# EAGLE design Wizard (EAGLE 9.4.0)
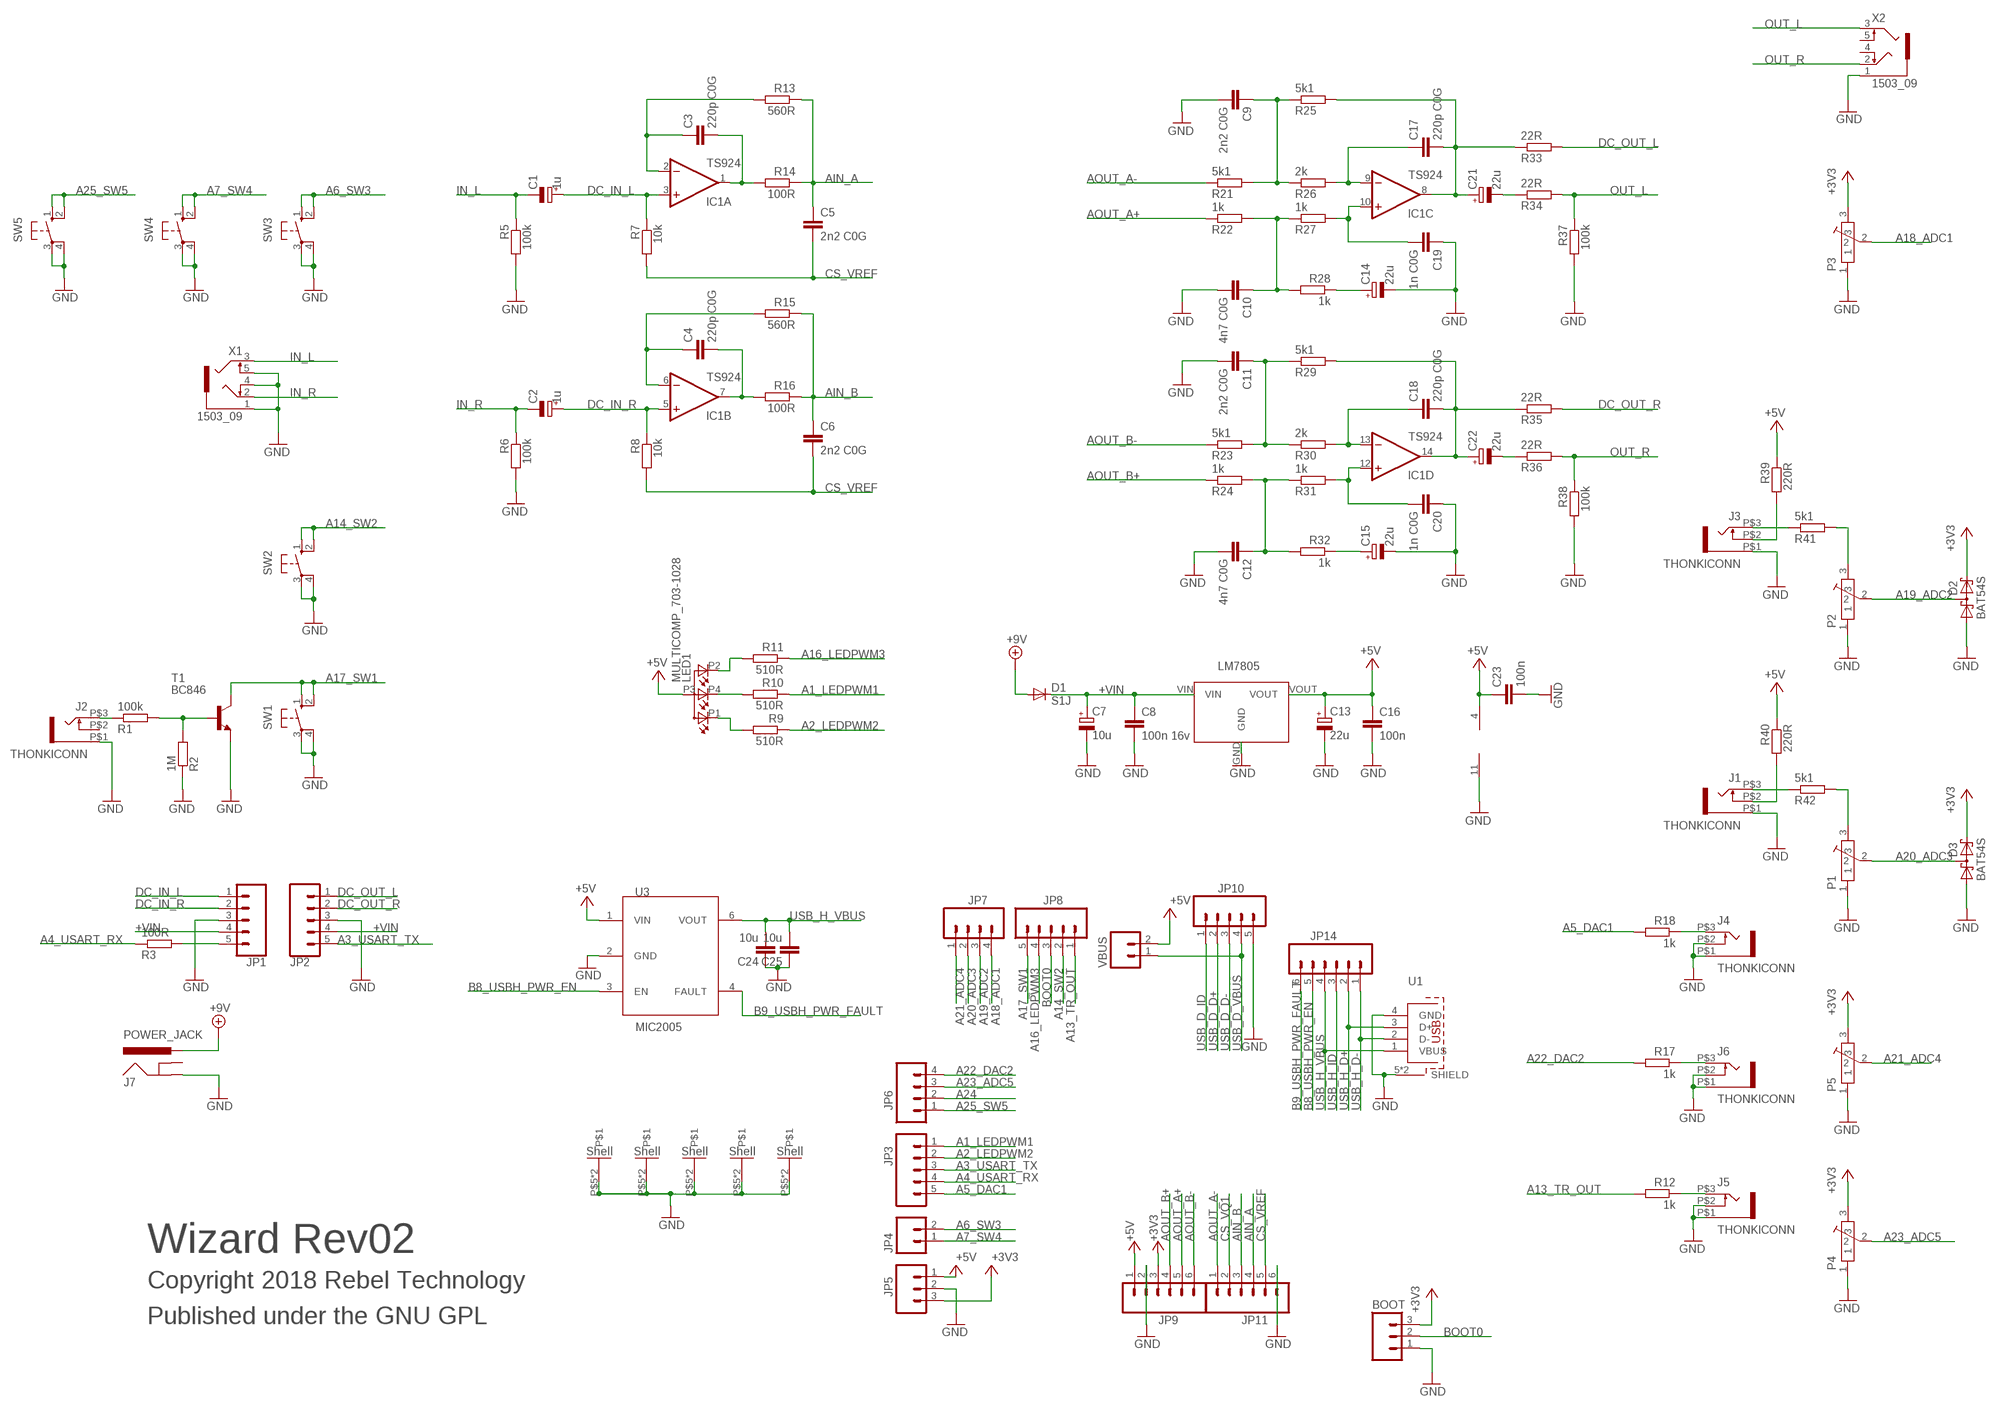
[diagram p0: schematic, sheet 1]

## Parts
BOOT  M03PTH  [1X03]
C1  1u  CPOL-EU153CLV-0405  [153CLV-0405]
C2  1u  CPOL-EU153CLV-0405  [153CLV-0405]
C3  220p C0G  C-EUC0603  [C0603]
C4  220p C0G  C-EUC0603  [C0603]
C5  2n2 C0G  C-EUC0603  [C0603]
C6  2n2 C0G  C-EUC0603  [C0603]
C7  10u  CPOL-EU153CLV-0405  [153CLV-0405]
C8  100n 16v  C-EUC0603  [C0603]
C9  2n2 C0G  C-EUC0603  [C0603]
C10  4n7 C0G  C-EUC0603  [C0603]
C11  2n2 C0G  C-EUC0603  [C0603]
C12  4n7 C0G  C-EUC0603  [C0603]
C13  22u  CPOL-EU153CLV-0505  [CPOL-5]
C14  22u  CPOL-EU153CLV-0505  [CPOL-5]
C15  22u  CPOL-EU153CLV-0505  [CPOL-5]
C16  100n  C-EUC0603  [C0603]
C17  220p C0G  C-EUC0603  [C0603]
C18  220p C0G  C-EUC0603  [C0603]
C19  1n C0G  C-EUC0603  [C0603]
C20  1n C0G  C-EUC0603  [C0603]
C21  22u  CPOL-EU153CLV-0505  [CPOL-5]
C22  22u  CPOL-EU153CLV-0505  [CPOL-5]
C23  100n  C-EUC0603  [C0603]
C24  10u  C-EUC0603  [C0603]
C25  10u  C-EUC0603  [C0603]
D1  S1J  DIODESMA  [SMA-DIODE]
D2  BAT54S  [SOT23]
D3  BAT54S  [SOT23]
IC1  TS924  LM324D  [SO14]
J1  THONKICONN  [THONKICONN]
J2  THONKICONN  [THONKICONN]
J3  THONKICONN  [THONKICONN]
J4  THONKICONN  [THONKICONN]
J5  THONKICONN  [THONKICONN]
J6  THONKICONN  [THONKICONN]
J7  POWER_JACK  [DC_JACK_SLOT]
JP1  CONN_05JST-VERT  [JST-5-PTH-VERT]
JP2  CONN_05JST-VERT  [JST-5-PTH-VERT]
JP3  M05PTH  [1X05]
JP4  M02PTH  [1X02]
JP5  M03PTH  [1X03]
JP6  M04PTH  [1X04]
JP7  M04PTH  [1X04]
JP8  M05PTH  [1X05]
JP9  M06SIP  [1X06]
JP10  M05PTH  [1X05]
JP11  M06SIP  [1X06]
JP14  M06SIP  [1X06]
LED1  MULTICOMP_703-1028  [RGB-LED-703-1028]
P1  POT-ALPS-RK09L1140  [POT-ALPS-RK09L1140]
P2  POT-ALPS-RK09L1140  [POT-ALPS-RK09L1140]
P3  POT-ALPS-RK09L1140  [POT-ALPS-RK09L1140]
P4  POT-ALPS-RK09L1140  [POT-ALPS-RK09L1140]
P5  POT-ALPS-RK09L1140  [POT-ALPS-RK09L1140]
R1  100k  R-EU_0603  [0603]
R2  1M  R-EU_0603  [0603]
R3  100R  R-EU_0603  [0603]
R5  100k  R-EU_0603  [0603]
R6  100k  R-EU_0603  [0603]
R7  10k  R-EU_0603  [0603]
R8  10k  R-EU_0603  [0603]
R9  510R  R-EU_0603  [0603]
R10  510R  R-EU_0603  [0603]
R11  510R  R-EU_0603  [0603]
R12  1k  R-EU_0603  [0603]
R13  560R  R-EU_0603  [0603]
R14  100R  R-EU_0603  [0603]
R15  560R  R-EU_0603  [0603]
R16  100R  R-EU_0603  [0603]
R17  1k  R-EU_0603  [0603]
R18  1k  R-EU_0603  [0603]
R21  5k1  R-EU_0603  [0603]
R22  1k  R-EU_0603  [0603]
R23  5k1  R-EU_0603  [0603]
R24  1k  R-EU_0603  [0603]
R25  5k1  R-EU_0603  [0603]
R26  2k  R-EU_0603  [0603]
R27  1k  R-EU_0603  [0603]
R28  1k  R-EU_0603  [0603]
R29  5k1  R-EU_0603  [0603]
R30  2k  R-EU_0603  [0603]
R31  1k  R-EU_0603  [0603]
R32  1k  R-EU_0603  [0603]
R33  22R  R-EU_0603  [0603]
R34  22R  R-EU_0603  [0603]
R35  22R  R-EU_0603  [0603]
R36  22R  R-EU_0603  [0603]
R37  100k  R-EU_0603  [0603]
R38  100k  R-EU_0603  [0603]
R39  220R  R-EU_0603  [0603]
R40  220R  R-EU_0603  [0603]
R41  5k1  R-EU_0603  [0603]
R42  5k1  R-EU_0603  [0603]
SW1  10-XX  [B3F-10XX]
SW2  10-XX  [B3F-10XX]
SW3  10-XX  [B3F-10XX]
SW4  10-XX  [B3F-10XX]
SW5  10-XX  [B3F-10XX]
T1  BC846  [SOT23]
U1  614104190121  [614104190121]
U2  LM7805  REG_S9V11F5  [REG_S9V11F5]
U3  MIC2005  [SOT23-6]
VBUS  M02PTH  [1X02]
X1  1503_09  [1503_09]
X2  1503_09  [1503_09]

## Nets
+3V3: BOOT.3 D2.2(C2) D3.2(C2) JP5.3 JP9.3 P3.3 P4.3 P5.3
+5V: C13.+ C16.1 C23.1 IC1.4(P:V+) JP5.1 JP9.1 LED1.P3(A) R39.1 R40.1 U2.VOUT U3.1(VIN) VBUS.2
+9V: D1.A J7.PWR
+VIN: C7.+ C8.1 D1.C JP1.4 JP2.4 U2.VIN
A1_LEDPWM1: JP3.1 R10.1
A2_LEDPWM2: JP3.2 R9.1
A3_USART_TX: JP2.5 JP3.3
A4_USART_RX: JP3.4 R3.1
A5_DAC1: JP3.5 R18.2
A6_SW3: JP4.2 SW3.1(S) SW3.2(S1)
A7_SW4: JP4.1 SW4.1(S) SW4.2(S1)
A13_TR_OUT: JP8.1 R12.2
A14_SW2: JP8.2 SW2.1(S) SW2.2(S1)
A16_LEDPWM3: JP8.4 R11.1
A17_SW1: JP8.5 SW1.1(S) SW1.2(S1) T1.3(C)
A18_ADC1: JP7.4 P3.2
A19_ADC2: D2.3(C1A2) JP7.3 P2.2
A20_ADC3: D3.3(C1A2) JP7.2 P1.2
A21_ADC4: JP7.1 P5.2
A22_DAC2: JP6.4 R17.2
A23_ADC5: JP6.3 P4.2
A24: JP6.2
A25_SW5: JP6.1 SW5.1(S) SW5.2(S1)
AIN_A: C5.1 JP11.4 R13.1 R14.1
AIN_B: C6.1 JP11.3 R15.1 R16.1
AOUT_A+: JP9.5 R22.1
AOUT_A-: JP11.1 R21.1
AOUT_B+: JP9.4 R24.1
AOUT_B-: JP9.6 R23.1
B8_USBH_PWR_EN: JP14.5 U3.3(EN)
B9_USBH_PWR_FAULT: JP14.6 U3.4(FAULT)
BOOT0: BOOT.2 JP8.3
CS_VQ1: JP11.2
CS_VREF: C5.2 C6.2 JP11.5 R7.2 R8.2
DC_IN_L: C1.+ IC1.3(A:+IN) JP1.1 R7.1
DC_IN_R: C2.+ IC1.5(B:+IN) JP1.2 R8.1
DC_OUT_L: JP2.1 R33.2
DC_OUT_R: JP2.2 R35.2
GND: BOOT.1 C7.- C8.2 C9.2 C10.2 C11.2 C12.2 C13.- C14.- C15.- C16.2 C19.1 C20.1 C23.2 C24.1 C25.1 D2.1(A1) D3.1(A1) IC1.11(P:V-) J1.P$1 J2.P$1 J3.P$1 J4.P$1 J4.P$2 J5.P$1 J5.P$2 J6.P$1 J6.P$2 J7.GND JP1.3 JP2.3 JP5.2 JP9.2 JP10.5 JP11.6 P1.1 P1.P$5 P1.P$6 P2.1 P2.P$5 P2.P$6 P3.1 P3.P$5 P3.P$6 P4.1 P4.P$5 P4.P$6 P5.1 P5.P$5 P5.P$6 R2.1 R5.2 R6.2 R37.2 R38.2 SW1.3(P) SW1.4(P1) SW2.3(P) SW2.4(P1) SW3.3(P) SW3.4(P1) SW4.3(P) SW4.4(P1) SW5.3(P) SW5.4(P1) T1.2(E) U1.4(GND) U1.5(SHIELD) U1.6(SHIELD) U2.GND U3.2(GND) X1.1 X1.4 X1.5 X2.1
IN_L: C1.- R5.1 X1.3
IN_R: C2.- R6.1 X1.2
N$1: JP1.5 R3.2
N$2: J1.P$2 R40.2
N$3: C3.1 IC1.2(A:-IN) R13.2
N$4: C4.2 IC1.7(B:OUT) R16.2
N$5: C4.1 IC1.6(B:-IN) R15.2
N$6: C3.2 IC1.1(A:OUT) R14.2
N$7: C17.1 IC1.9(C:-IN) R26.2
N$8: C15.+ R32.1
N$9: C21.- R34.1
N$10: C14.+ R28.1
N$11: C19.2 IC1.10(C:+IN) R27.2
N$12: C18.2 C22.+ IC1.14(D:OUT) R29.2 R35.1
N$13: C22.- R36.1
N$14: LED1.P2(CGREEN) R11.2
N$15: C10.1 R22.2 R27.1 R28.2
N$16: LED1.P1(CRED) R9.2
N$17: LED1.P4(CBLUE) R10.2
N$19: J5.P$3 R12.1
N$20: J6.P$3 R17.1
N$21: J4.P$3 R18.1
N$22: J2.P$3 R1.1
N$23: J3.P$2 R39.2
N$24: C11.1 R23.2 R29.1 R30.1
N$25: P2.3 R41.2
N$26: C18.1 IC1.13(D:-IN) R30.2
N$27: J3.P$3 R41.1
N$30: C20.2 IC1.12(D:+IN) R31.2
N$31: P1.3 R42.2
N$32: C12.1 R24.2 R31.1 R32.2
N$33: J1.P$3 R42.1
N$37: R1.2 R2.2 T1.1(B)
N$39: C17.2 C21.+ IC1.8(C:OUT) R25.2 R33.1
N$41: C9.1 R21.2 R25.1 R26.1
OUT_L: R34.2 R37.1 X2.3
OUT_R: R36.2 R38.1 X2.2
USB_D_D+: JP10.2
USB_D_D-: JP10.3
USB_D_ID: JP10.1
USB_D_VBUS: JP10.4 VBUS.1
USB_H_D+: JP14.2 U1.3(D+)
USB_H_D-: JP14.1 U1.2(D-)
USB_H_ID: JP14.3
USB_H_VBUS: C24.2 C25.2 JP14.4 U1.1(VBUS) U3.6(VOUT)
Unconnected: J2.P$2 J7.GNDBREAK X2.4 X2.5

## Notes on the sheet
- Wizard Rev02
- Copyright 2018 Rebel Technology
- Published under the GNU GPL

## Library data of the parts
BOOT JP5 = SparkFun:M03: Header 3 Standard 3-pin 0.1" header. Use with straight break away headers (SKU : PRT-00116), right angle break away headers (PRT-00553), swiss pins (PRT-00743), machine pins (PRT-00117), and female headers (PRT-00115). Molex polarized connector foot print use with SKU : PRT-08232 with associated crimp pins and housings.
C1 C2 C7 C13-C15 C21 C22 = Rebel:CPOL-EU: POLARIZED CAPACITOR, European symbol
C3-C6 C9-C12 C17-C20 C23-C25 = resistor:C-EU: CAPACITOR, European symbol
C8 C16 = Rebel:C-EU: CAPACITOR, European symbol
D1 = SparkFun:DIODE: Diode These are standard reverse protection diodes and small signal diodes. SMA package can handle up to about 1A. SOD-323 can handle about 200mA. What the SOD-323 package when ordering, there are some mfgs out there that are 5-pin packages.
D2 D3 = diode:BAT54S: Schottky Diodes Pin connection corrected 2011-05-04 Source: Fairchild .. BAT54.pdf
IC1 = linear:LM324: OP AMP
J1-J6 = Rebel:THONKICONN
J7 = Rebel:POWER_JACK: Power Jack This is the standard 5.5mm barrel jack for power. The PTH is the most common, proven, reliable, footprint. All others are experimental. The Slot footprint only works if the mill layer is transmitted to the PCB fab house so be warned. Spark Fun Electronics SKU : PRT-00119. Mating wall wart : TOL-00298 (and others)
JP1 JP2 = SparkFun-Connectors:CONN_05: Multi connection point. Often used as Generic Header-pin footprint for 0.1 inch spaced/style header connections On any of the 0.1 inch spaced packages, you can populate with these: Break Away Headers - Straight <https://www.sparkfun.com/products/116> (PRT-00116) Break Away Male Headers - Right Angle <https://www.sparkfun.com/products/553> (PRT-00553) Female Headers <https://www.sparkfun.com/products/115> (PRT-00115) Break Away Headers - Machine Pin <https://www.sparkfun.com/products/117> (PRT-00117) Break Away Female Headers - Swiss Machine Pin <https://www.sparkfun.com/products/743> (PRT-00743) For SCREWTERMINALS and SPRING TERMINALS visit here: Screw Terimnals on SparkFun.com <https://www.sparkfun.com/search/results?term=Screw+Terminals> (5mm/3.5mm/2.54mm spacing) This device is also useful as a general connection point to wire up your design to another part of your project. Our various solder wires solder well into these plated through hole pads. Hook-Up Wire - Assortment (Stranded, 22 AWG) <https://www.sparkfun.com/products/11375> (PRT-11375) Hook-Up Wire - Assortment (Solid Core, 22 AWG) <https://www.sparkfun.com/products/11367> (PRT-11367) View the entire wire category on our website here <https://www.sparkfun.com/categories/141> Special notes: Molex polarized connector foot print use with SKU : PRT-08231 with associated crimp pins and housings. 1MM SMD Version SKU: PRT-10208
JP3 JP8 JP10 = SparkFun:M05: Header 5 Standard 5-pin 0.1" header. Use with straight break away headers (SKU : PRT-00116), right angle break away headers (PRT-00553), swiss pins (PRT-00743), machine pins (PRT-00117), and female headers (PRT-00115). Molex polarized connector foot print use with SKU : PRT-08230 with associated crimp pins and housings.
JP4 VBUS = SparkFun:M02: Header 2 Standard 2-pin 0.1" header. Use with straight break away headers (SKU : PRT-00116), right angle break away headers (PRT-00553), swiss pins (PRT-00743), machine pins (PRT-00117), and female headers (PRT-00115). Molex polarized connector foot print use with SKU : PRT-08233 with associated crimp pins and housings.
JP6 JP7 = SparkFun:M04: Header 4 Standard 4-pin 0.1" header. Use with straight break away headers (SKU : PRT-00116), right angle break away headers (PRT-00553), swiss pins (PRT-00743), machine pins (PRT-00117), and female headers (PRT-00115). Molex polarized connector foot print use with SKU : PRT-08231 with associated crimp pins and housings. 1MM SMD Version SKU: PRT-10208
JP9 JP11 JP14 = SparkFun:M06: Header 6 Standard 6-pin 0.1" header. Use with straight break away headers (SKU : PRT-00116), right angle break away headers (PRT-00553), swiss pins (PRT-00743), machine pins (PRT-00117), and female headers (PRT-00115). Molex polarized connector foot print use with SKU : PRT-08094 with associated crimp pins and housings. NOTES ON THE VARIANTS LOCK and LOCK_LONGPADS... This footprint was designed to help hold the alignment of a through-hole component (i.e. 6-pin header) while soldering it into place. You may notice that each hole has been shifted either up or down by 0.005 of an inch from it's more standard position (which is a perfectly straight line). This slight alteration caused the pins (the squares in the middle) to touch the edges of the holes. Because they are alternating, it causes a "brace" to hold the component in place. 0.005 has proven to be the perfect amount of "off-center" position when using our standard breakaway headers. Although looks a little odd when you look at the bare footprint, once you have a header in there, the alteration is very hard to notice. Also, if you push a header all the way into place, it is covered up entirely on the bottom side. This idea of altering the position of holes to aid alignment will be further integrated into the Sparkfun Library for other footprints. It can help hold any component with 3 or more connection pins.
LED1 = Rebel:MULTICOMP_703-1028: Farnell: 2112143
P1-P5 = Rebel:POT-ALPS-RK09L
R1-R3 R5-R18 R21-R42 = Rebel:R-EU_: RESISTOR, European symbol
SW1-SW5 = switch-omron:10-XX: OMRON SWITCH; MPN: B3F-1000; OC_FARNELL: 176432; OC_NEWARK: 36M3542
T1 = transistor:BC846: NPN TRANSISTOR
U1 = Wurth-connectors:614104190121: USB TYPE A HORIZONTAL THT -SHORT TYPE =>ConUSB2 614104190121 Characteristics INSULATOR: LCP FLAMMABILITY RATING: UL94-V0 COLOR: BLACK CONTACT MATERIAL: COPPER ALLOY CONTACT PLATING: GOLD OVER Ni COVER MATERIAL: STAINLESS STEEL COVER PLATING: Ni QUALITY CLASS: 5 000 MATING CYCLES OPERATING TEMPERATURE:-55°C UP TO +85°C COMPLIANCE: LEAD FREE AND ROHS ELECTRICAL CURRENT RATING: 1.5A WORKING VOLTAGE: 30 VAC MAX WITHSTANDING VOLTAGE: 500 VAC/MIN INSULATION RESISTANCE: > 1000 MΩ CONTACT RESISTANCE: 30 mΩ MAX <http://katalog.we-online.de/media/images/v2/Family_WR-COM_614104190121_4C.jpg> Details see: http://katalog.we-online.de/en/em/COM_THT_TYPE_A_HORIZONTAL/614104190121 2015 (C) Wurth Elektronik
U2 = Rebel:REG_S9V11F5
U3 = James:MIC2005; OC_FARNELL: 2509882
X1 X2 = con-lumberg:1503_09: Jack connectors according to JISC 6560, 3.5 mm Klinkeneinbaukupplung nach JISC 6560, 3,5 mm, 3-polig/ stereo, abgewinkelte Ausführung, mit 2 Öffnern und Lötaugen, für Leiterplatten Rückseitenmontage Source: http://www.lumberg.com/Produkte/PDFs/1503_09.pdf; OC_FARNELL: 1243244; OC_NEWARK: unknown

## Net classes
1 power: width 0.178 mm, drill 0.305 mm, clearance 0.178 mm to class 0, clearance 0.178 mm

## Board
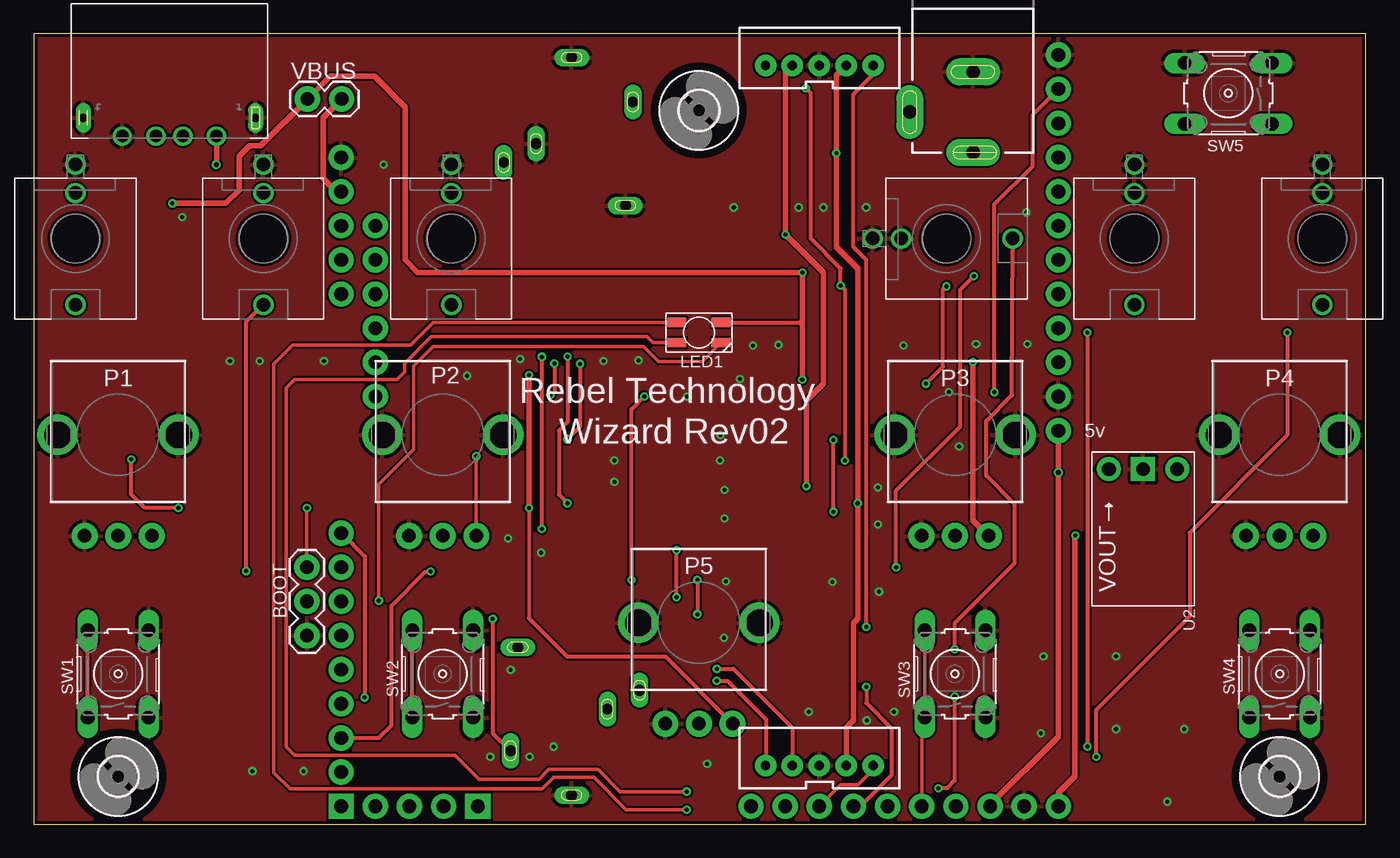
[diagram p1: board, top side]
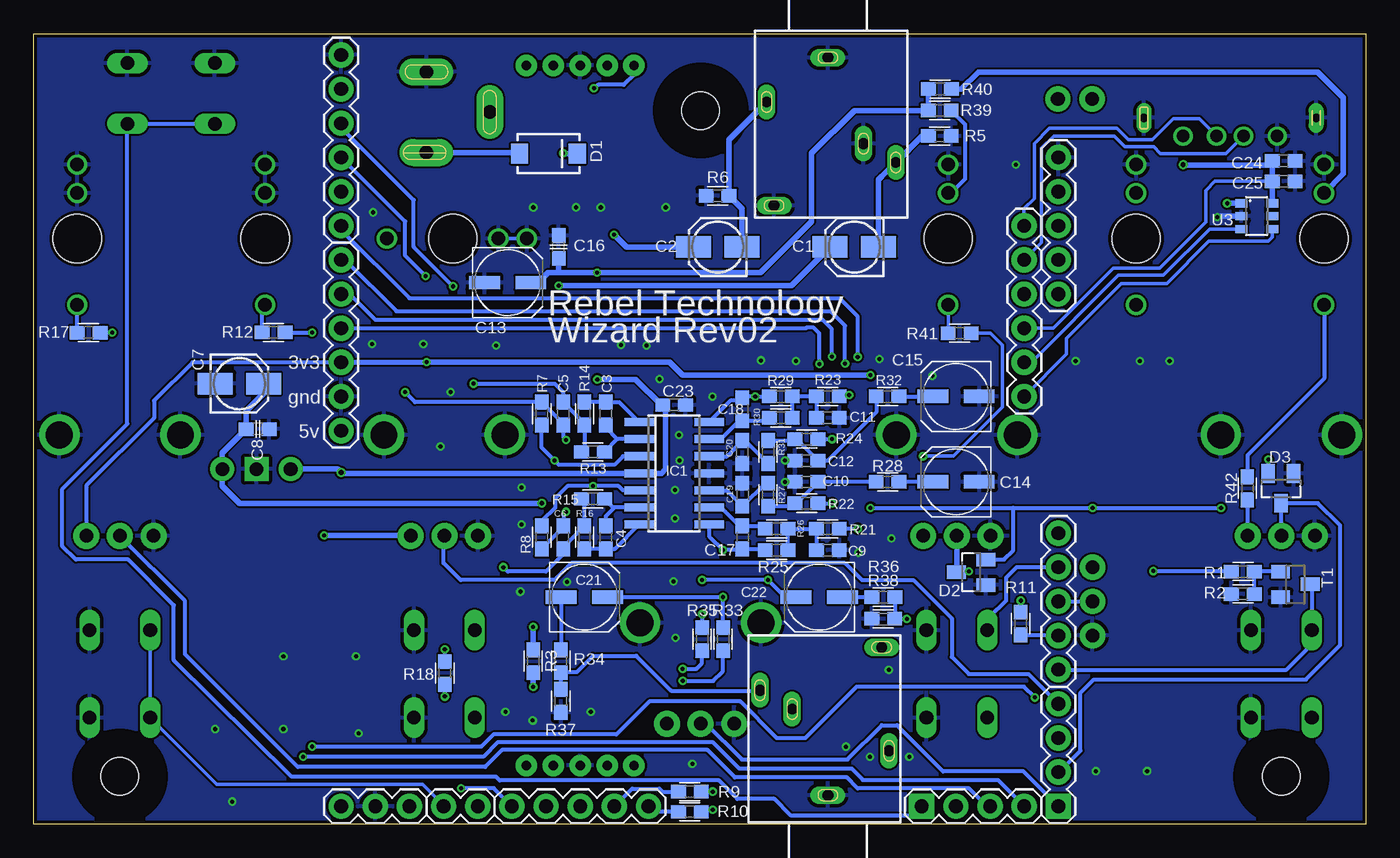
[diagram p2: board, bottom side, seen from below]

Size 99.06 x 58.8 mm. Coordinates in mm from the lower left corner, seen from the top.
Outline: 99.06,58.8 0,58.8 0,0 99.06,0 99.06,58.8
Copper layers (1*16): Top 0.035mm / dielectric 1.5mm / Bottom 0.035mm
Design rules "Fusion_eagle_rule_v1.1": minimum track width 6mil, minimum drill 12mil, track to track 6mil, track to pad 6mil, pad to pad 6mil, via to via 6mil, smd to smd 0mil, copper to edge 10mil, drill to drill 10mil, minimum pad ring 10mil, minimum via ring 6mil, stop-mask expansion 2mil, vias tented up to drill 100mil, thermal gap 10mil

### Footprints (pad centres in the part's own frame; a part is rotated, then mirrored left to right if it is on the bottom)
1X03 = drill 1.016 pad 1.88: 1 0,0; 2 2.54,0; 3 5.08,0
153CLV-0405 = smd 2.6 x 1.6: + 1.8,0; - -1.8,0
C0603 = smd 1.1 x 1: 1 -0.85,0; 2 0.85,0
CPOL-5 = smd 2.3 x 1: + 1.725,0; - -1.725,0
SMA-DIODE = smd 1.27 x 1.47: A -2.15,0; C 2.15,0
SOT23 = smd 1 x 1.4: 1 -0.95,-1.1; 2 0.95,-1.1; 3 0,1.1
SO14 = smd 0.6 x 2.2: 1 -3.81,-2.6; 2 -2.54,-2.6; 3 -1.27,-2.6; 4 0,-2.6; 5 1.27,-2.6; 6 2.54,-2.6; 7 3.81,-2.6; 8 3.81,2.6; 9 2.54,2.6; 10 1.27,2.6; 11 0,2.6; 12 -1.27,2.6; 13 -2.54,2.6; 14 -3.81,2.6
THONKICONN = drill 1: P$1 0,-5.5; P$2 0,-3.38; P$3 0,4.92 | hole 3.6: 0,0
DC_JACK_SLOT = drill 1 pad 2 long: GND 0,4.743; GNDBREAK 4.697,7.742; PWR 0,10.749
JST-5-PTH-VERT = drill 0.7 pad 1.6: 1 -4,0.18; 2 -2,0.18; 3 0,0.18; 4 2,0.18; 5 4,0.18
1X05 = drill 1.016 pad 1.88: 1 0,0; 2 2.54,0; 3 5.08,0; 4 7.62,0; 5 10.16,0
1X02 = drill 1.016 pad 1.88: 1 0,0; 2 2.54,0
1X04 = drill 1.016 pad 1.88 square: 1 0,0 | drill 1.016 pad 1.88: 2 2.54,0; 3 5.08,0; 4 7.62,0
1X06 = drill 1.016 pad 1.88: 1 0,0; 2 2.54,0; 3 5.08,0; 4 7.62,0; 5 10.16,0; 6 12.7,0
RGB-LED-703-1028 = smd 0.7 x 1.4: P1 -0.75,1.65; P2 -0.75,-1.65; P3 0.75,-1.65; P4 0.75,1.65
POT-ALPS-RK09L1140 = drill 1 pad 1.93: 1 -2.5,-7.5; 2 0,-7.5; 3 2.5,-7.5 | drill 2: P$5 -4.5,0; P$6 4.5,0
0603 = smd 1.1 x 1: 1 -0.85,0; 2 0.85,0
B3F-10XX = drill 1.016 long: 1 -3.251,2.261; 2 3.251,2.261; 3 -3.251,-2.261; 4 3.251,-2.261
614104190121 = drill 0.92: 1 -3.5,0; 2 -1,0; 3 1,0; 4 3.5,0 | drill 0.6 long: 5 -6.4,-1.35; 6 6.4,-1.35
REG_S9V11F5 = drill 1.016 pad 1.778 square: GND 0,0 | drill 1.016 pad 1.778: VIN -2.54,0; VOUT 2.54,0
SOT23-6 = smd 0.6 x 0.9: 1 -0.95,-1.15; 2 0,-1.15; 3 0.95,-1.15; 4 0.95,1.15; 5 0,1.15; 6 -0.95,1.15
2,8 = hole 2.8: 0,0
1503_09 = drill 0.8 pad 1.2 long: 1 0,-2.1; 2 -4.55,-5.4; 3 5.05,-9.9; 4 -4,-13.1; 5 2.65,-8.5

### Placement (x,y rotation side)
BOOT  20.32,14.03 90 top
C1  38.04,42.93 180 bottom
C2  48.2,42.93 180 bottom
C3  56.51,30.54 90 bottom
C4  56.51,21.34 270 bottom
C5  59.69,30.54 270 bottom
C6  59.69,21.34 90 bottom
C7  83.76,32.77 0 bottom
C8  82.4,29.39 0 bottom
C9  40,20.38 0 bottom
C10  41.59,25.46 180 bottom
C11  40,30.23 0 bottom
C12  41.59,27.05 180 bottom
C13  63.82,40.29 0 bottom
C14  30.48,25.46 180 bottom
C15  30.48,31.81 180 bottom
C16  60.03,42.93 90 bottom
C17  46.35,21.34 270 bottom
C18  46.35,30.86 90 bottom
C19  46.35,24.51 270 bottom
C20  46.35,27.69 90 bottom
C21  58.1,16.89 0 bottom
C22  40.64,16.89 180 bottom
C23  51.43,31.18 0 bottom
C24  6.12,49.33 180 bottom
C25  6.12,47.83 180 bottom
D1  60.79,49.88 0 bottom
D2  29.34,18.74 90 bottom
D3  6.32,24.98 180 bottom
IC1  51.43,26.1 270 bottom
J1  3.11,43.56 180 top
J2  17.08,43.56 180 top
J3  31.05,43.56 180 top
J4  67.88,43.56 270 top
J5  81.85,43.56 180 top
J6  95.82,43.56 180 top
J7  69.85,60.71 180 top
JP1  58.42,56.26 0 top
JP2  58.42,4.19 0 top
JP3  53.34,1.33 180 bottom
JP4  68.58,1.33 0 bottom
JP5  71.12,1.33 180 bottom
JP6  33.02,1.33 0 bottom
JP7  22.86,1.33 90 bottom
JP8  22.86,21.65 270 bottom
JP9  76.2,29.27 90 bottom
JP10  22.86,39.43 90 bottom
JP11  76.2,44.51 90 bottom
JP14  25.4,44.51 270 bottom
LED1  49.47,36.58 90 top
P1  6.29,28.96 0 top
P2  30.42,28.96 0 top
P3  68.52,28.96 0 top
P4  92.65,28.96 0 top
P5  49.47,14.99 0 top
R1  9.15,18.79 0 bottom
R2  9.15,17.13 0 bottom
R3  61.91,12.13 90 bottom
R5  31.69,51.18 0 bottom
R6  48.2,46.74 180 bottom
R7  61.28,30.54 90 bottom
R8  61.28,21.34 270 bottom
R9  50.27,2.43 0 bottom
R10  50.27,0.93 0 bottom
R11  25.67,14.93 90 bottom
R12  81.22,36.58 0 bottom
R13  57.47,27.69 0 bottom
R14  58.1,30.54 90 bottom
R15  57.47,24.19 0 bottom
R16  58.1,21.34 270 bottom
R17  94.97,36.57 0 bottom
R18  68.48,11.25 270 bottom
R21  40,21.97 180 bottom
R22  41.59,23.88 180 bottom
R23  40,31.81 180 bottom
R24  41.59,28.64 180 bottom
R25  43.81,20.38 180 bottom
R26  43.81,21.97 180 bottom
R27  44.45,24.51 90 bottom
R28  35.56,25.46 180 bottom
R29  43.5,31.81 180 bottom
R30  43.5,30.23 180 bottom
R31  44.45,27.69 270 bottom
R32  35.56,31.81 180 bottom
R33  47.79,13.77 270 bottom
R34  59.86,12.13 270 bottom
R35  49.35,13.77 270 bottom
R36  35.88,16.89 0 bottom
R37  59.86,9.17 270 bottom
R38  35.88,15.28 180 bottom
R39  31.69,53.09 0 bottom
R40  31.67,54.68 0 bottom
R41  30.2,36.53 0 bottom
R42  8.82,24.98 270 bottom
SW1  6.29,11.18 90 top
SW2  30.42,11.18 90 top
SW3  68.52,11.18 90 top
SW4  92.65,11.18 90 top
SW5  88.84,54.36 180 top
T1  5.24,17.84 270 bottom
U1  10.1,51.18 180 top
U2  82.49,26.42 180 top
U3  8.12,45.23 270 bottom
U$1  [2,8]  6.29,3.56 0 top
U$2  [2,8]  92.65,3.56 0 top
U$3  [2,8]  49.47,53.09 0 top
VBUS  22.9,53.94 180 top
X1  40,59.12 0 bottom
X2  40,0.06 180 bottom

### Tracks (layer width: path | path; a pad name or v marks a point on that pad's centre or on a via)
+3V3  (via drill 0.3)
  Top 0.254: v20.32,23.53 BOOT.3
  Top 0.305: v10.77,23.53 8.27,23.53 7.27,24.53 v7.27,27.13 | v36.83,23.53 36.83,15.31 39.67,12.48 46.98,12.48 P5.3
  Top 0.406: v69.85,34.37 69.85,22.61 71,21.46 P3.3 71.02,21.44 | v36.83,33.4 v36.83,23.53 | JP5.3 76.2,2.35 77.41,3.56 77.41,21.42 v77.47,21.48
  Bottom 0.305: v7.27,27.13 D3.2 | 71.04,21.48 P3.3 | v36.83,23.53 26.22,23.53 | 26.22,23.53 v20.32,23.53 | v20.32,23.53 20.27,23.53 | 20.27,23.53 10.82,23.53 10.77,23.48 v10.77,23.53 | D2.2 26.9,19.69 26.22,20.38 26.22,23.53 | v20.32,23.53 20.27,23.53 | v20.32,23.53 | v20.32,23.53 | JP9.3 87.25,34.35 90.11,31.5 90.11,30.23 95.15,25.19 P4.3
  Bottom 0.406: JP9.3 v69.85,34.37 51.77,34.37 50.8,33.4 v36.83,33.4 | v77.47,21.48 71.04,21.48
+5V  (via drill 0.3, 0.35)
  Top 0.305: JP5.1 71.12,1.43 | LED1.P3 57.04,37.33 57.15,37.21
  Top 0.406: v57.15,33.08 57.15,37.21 | 71.12,1.43 76.2,6.51 v76.2,26.16 JP9.1 | 57.04,37.33 57.15,37.44 57.15,41.01 v57.17,41.03 28.57,41.03 27.62,41.98 27.62,53.35 25.34,55.63 22.05,55.63 VBUS.2 16.9,50.48 16.07,50.48 15.27,49.68 15.27,47.18 14.27,46.18 v10.32,46.18
  Bottom 0.305: R39.1 32.52,53.11
  Bottom 0.406: v57.15,33.08 54.29,33.08 52.39,31.18 C23.1 52.07,30.96 52.07,26.42 52.39,26.1 IC1.4 76.14,26.1 v76.2,26.16 76.45,26.42 U2.VOUT | 32.52,53.11 R40.1 | 59.97,41.02 60.82,41.02 61.37,40.48 62,40.48 C13.+ | C16.1 60.03,41.08 59.97,41.02 | R39.1 38.04,53.09 41.21,49.91 41.21,44.83 45.02,41.02 57.15,41.02 57.15,41.03 v57.17,41.03 59.97,41.03 59.97,41.02 | U3.1 v10.32,46.18
+9V
  Bottom 0.406: D1.A 63.02,49.96 J7.PWR
+VIN  (via drill 0.3)
  Top 0.406: JP1.4 59.68,55.7 v59.68,49.91 59.68,42.94 61.28,41.34 v61.28,23.88 61.28,15.3 60.96,14.99 60.96,7.75 60.42,7.21 JP2.4
  Bottom 0.406: C7.+ 81.96,32.03 83.25,30.73 C8.1 85.03,27.61 U2.VIN 85.03,25.15 83.76,23.88 v61.28,23.88 | D1.C 59.65,49.88 v59.68,49.91
A1_LEDPWM1
  Bottom 0.305: R10.1 52.93,0.93 JP3.1
A2_LEDPWM2
  Bottom 0.305: JP3.2 54.56,2.65 52.54,2.65 52.32,2.43 R9.1
A3_USART_TX
  Top 0.254: JP3.3 60.01,2.92 61.28,2.92 62.42,4.06 JP2.5
A4_USART_RX  (via drill 0.3)
  Top 0.305: v61.91,10.22 61.91,9.02 63.82,7.11 63.82,3.68 61.47,1.33 JP3.4
  Bottom 0.406: R3.1 v61.91,10.22
A5_DAC1  (via drill 0.3)
  Top 0.305: v68.48,9.5 68.48,3.27 67.89,2.68 v67.28,2.68
  Bottom 0.305: JP3.5 64.84,2.68 v67.28,2.68 | v68.48,9.5 R18.2
A6_SW3
  Top 0.254: SW3.1 SW3.2 | JP4.2 66.04,6.95 66.28,7.19 66.28,7.9
  Top 0.406: 66.28,7.9 SW3.1
A7_SW4
  Bottom 0.254: JP4.1 68.58,1.41 70.14,2.97 85.43,2.97 86.07,3.61 SW4.1 SW4.2
A13_TR_OUT  (via drill 0.3)
  Top 0.254: JP8.1 22.89,21.65
  Top 0.305: v78.36,36.58 v78.36,5.78 | 22.89,21.65 24.62,19.93 v24.62,9.43
  Bottom 0.305: R12.2 v78.36,36.58 | v24.62,9.43 25.42,10.23 37.87,10.23 41.69,6.4 43.79,6.4 46.52,9.13 53.27,9.13 55.72,6.68 64.87,6.68 65.76,5.78 v78.36,5.78
A14_SW2
  Top 0.305: SW2.1 SW2.2
  Bottom 0.305: 22.86,19.08 JP8.2 25.98,19.11 26.77,18.33 26.77,16.63 28.02,15.38 28.02,14.57 SW2.2
A16_LEDPWM3
  Bottom 0.305: JP8.4 25.62,14.03 R11.1
A17_SW1
  Top 0.305: SW1.1 SW1.2
  Bottom 0.305: SW1.2 4.03,15.42 | T1.3 4.03,17.47 SW1.2 | JP8.5 5.91,11.49 4.03,13.38 SW1.2
A18_ADC1
  Bottom 0.305: P3.2 68.58,21.39 68.58,19.43 67.31,18.16 60.32,18.16 59.06,19.43 38.74,19.43 37.46,18.16 33.66,18.16 30.8,15.3 30.8,12.45 29.53,11.18 25.1,11.18 22.88,8.95 JP7.4
A19_ADC2  (via drill 0.3)
  Top 0.305: JP7.3 25.65,6.41 26.61,7.37 26.61,16.26 29.15,18.8 v29.53,18.8
  Bottom 0.305: 30.42,18.74 29.58,18.74 v29.53,18.8
  Bottom 0.406: D2.3 30.42,18.74 P2.2
A20_ADC3
  Bottom 0.305: P1.2 6.32,21.49 D3.3 3.57,23.88 1.92,22.23 1.92,13.33 4.47,10.78 20.22,10.78 21.22,9.78 21.22,5.47 22.81,3.87 JP7.2
A21_ADC4
  Bottom 0.305: JP7.1 25.46,3.94 31.43,3.94 34.86,7.37 36,7.37 38.54,4.83 46.39,4.83 49.05,7.49 P5.2
A22_DAC2  (via drill 0.3)
  Top 0.305: v93.22,36.57 93.22,28.95 85.95,21.68 85.95,15.44 79.03,8.52 v79.03,5.03
  Bottom 0.254: 94.22,36.57 R17.2 | 93.32,36.57 v93.22,36.57
  Bottom 0.305: v79.03,5.03 65.62,5.03 64.57,6.08 48.54,6.08 46.59,4.13 38.23,4.13 37.4,3.3 27.37,3.3 JP6.4 | 94.22,36.57 93.32,36.57
A23_ADC5
  Bottom 0.305: P4.2 87.8,16.61 87.8,12.64 79.42,4.26 65.49,4.26 64.22,5.53 48.97,5.53 46.92,3.48 38.6,3.48 37.79,2.67 29.53,2.67 28.19,1.33 JP6.3
A25_SW5
  Bottom 0.305: JP6.1 33.72,0.63 42.74,0.63 43.98,1.88 46.73,1.88 48.12,3.27 64.4,3.27 64.68,3.54 79.86,3.54 88.63,12.19 88.63,16.29 92.02,19.68 95.93,19.68 96.92,20.68 96.92,24.94 92.09,29.78 SW5.1 SW5.2
AIN_A  (via drill 0.3)
  Top 0.305: v66.36,32.77 67.63,34.04 67.63,39.75 v67.88,40.01
  Bottom 0.305: R13.1 58.1,27.9 R14.1 58.1,29.81 C5.1 59.69,32.13 60.32,32.77 v66.36,32.77 | v67.88,40.01 70.8,42.93 70.8,46.42 76.2,51.82 JP11.4
AIN_B  (via drill 0.3)
  Top 0.305: v64.14,19.11 64.14,24.83 68.9,29.59 68.9,39.75 v69.91,40.77
  Bottom 0.305: R16.1 58.1,22.07 | R16.1 58.1,23.98 R15.1 | v64.14,19.11 63.82,18.8 60.96,18.8 59.69,20.07 C6.1 59.69,20.6 R16.1 | v69.91,40.77 71.44,42.29 71.44,44.83 JP11.3
AOUT_A+  (via drill 0.3)
  Top 0.305: v39.71,34.78 39.69,34.81 39.69,29.91 39.05,29.27 39.05,24.51 v39.69,23.88
  Bottom 0.305: R22.1 v39.69,23.88 | JP9.5 75.57,39.43 73.66,37.53 40.42,37.53 39.71,36.81 v39.71,34.78
AOUT_A-  (via drill 0.3)
  Top 0.305: v37.78,34.76 v37.78,21.97
  Bottom 0.305: v37.78,21.97 R21.1 | JP11.1 76.2,44.2 71.12,39.12 39.16,39.12 37.78,37.74 v37.78,34.76
AOUT_B+  (via drill 0.3)
  Top 0.305: v40.64,34.24 40.64,29.59 v39.69,28.64
  Bottom 0.305: R24.1 v39.69,28.64 | JP9.4 41.6,36.91 41.59,36.93 41.07,36.93 40.64,36.5 v40.64,34.24
AOUT_B-  (via drill 0.3)
  Top 0.305: v38.72,34.26 38.74,34.13 38.74,32.13 v38.42,31.92
  Bottom 0.305: v38.42,31.92 R23.1 | JP9.6 75.88,41.97 72.07,38.16 39.8,38.16 38.72,37.08 v38.72,34.26
B8_USBH_PWR_EN
  Bottom 0.254: U3.3 11.62,44.28 15.07,40.83 18.42,40.83 24.89,34.35 JP14.5
B9_USBH_PWR_FAULT
  Bottom 0.254: U3.4 6.97,43.68 7.27,43.38 11.67,43.38 14.82,40.23 18.17,40.23 22.26,36.13 22.26,34.95 JP14.6
BOOT0
  Bottom 0.305: JP8.3 BOOT.2
CS_VREF  (via drill 0.3)
  Top 0.305: v71.44,32.13 71.44,46.1 74.29,48.96 74.29,52.77 JP11.5 | v59.47,23.24 v59.47,28.59
  Bottom 0.305: R8.2 59.69,22.07 C6.2 59.67,22.19 59.67,23.03 v59.47,23.24 | v71.44,32.13 70.7,31.39 R7.2 59.69,29.81 C5.2 59.69,28.81 v59.47,28.59
DC_IN_L  (via drill 0.3)
  Top 0.305: v60.32,27.05 60.32,39.75 v60.01,40.07 60.01,41.34 57.79,43.56 57.79,54.36 v57.4,54.74
  Bottom 0.305: IC1.3 55.24,27.37 55.88,26.73 60.01,26.73 v60.32,27.05 61.28,28 R7.1 | v57.4,54.74 57.34,54.74 57.09,54.99 55.18,54.99 54.42,55.75 JP1.1
  Bottom 0.406: v60.01,40.07 42.69,40.07 C1.+
DC_IN_R  (via drill 0.3)
  Top 0.305: 55.88,43.83 v55.91,43.85
  Top 0.406: v57.47,25.15 57.47,31.5 58.74,32.77 58.74,41.02 v55.91,43.85 55.91,55.93 JP1.2
  Bottom 0.305: IC1.5 55.24,24.83 55.56,25.15 v57.47,25.15 59.37,25.15 60.26,24.26 60.26,23.56 61.28,22.54 R8.1
  Bottom 0.406: C2.+ 54.99,42.93 v55.91,43.85
DC_OUT_L  (via drill 0.3)
  Top 0.305: JP2.1 54.48,4.45 54.48,7.78 51.6,10.66 v50.79,10.66
  Bottom 0.305: v50.79,10.66 48.53,10.66 47.82,11.38 47.82,12.89 R33.2
DC_OUT_R  (via drill 0.3)
  Top 0.305: v50.8,11.56 52.03,11.56 56.42,7.17 JP2.2
  Bottom 0.305: v50.8,11.56 49.78,11.56 49.37,11.98 49.37,12.9 R35.2
GND  (via drill 0.3)
  Bottom 0.254: J4.P$1 J4.P$2
  Bottom 0.305: C12.2 v43.18,27.05 | C10.2 v43.18,25.46
  Bottom 0.406: U3.2 10.97,45.23 v11.05,45.15
  other vias: 64.67,35.61 70.09,35.71 73.9,35.71 73.81,45.51 20.08,3.95 51.08,28.95 51.03,27.05 51.38,24.85 51.38,22.75 52.53,33.1 48.58,31.8 37.73,20.2 51.48,18.05 59.4,18.03 62.87,17.3 62.78,25.05 62.78,22.3 42.38,34.45 44.98,34.5 53.48,35.6 55.38,35.65 35.28,21.25 21.58,34.45 50.08,4.5 57.63,8.35 51.33,13.85 36.18,34.6 32.23,33.35 80.49,7.08 85.57,7.08 80.49,12.48 75.09,12.48 16.82,34.45 14.6,34.45 16.27,3.95 52.06,45.88 56.89,45.88 58.73,45.88 61.9,45.88 26.02,49.06 84.3,1.68 74.9,6.76 63.98,8.35 38.65,5.77 35.47,11.49 61.95,7.72 36.87,5.01 33.95,5.01 68.82,28.09 68.05,32.15
  pour Bottom: -13.97,-2.79 -13.97,63.25 115.57,63.25 115.57,-2.79
  pour Top: -12.7,-4.06 -12.7,61.98 116.84,61.98 116.84,-4.06
IN_L
  Bottom 0.305: R5.1 32.99,51.18
  Bottom 0.406: 32.99,51.18 X1.3 35.98,48.19 36.24,47.94 C1.-
IN_R
  Bottom 0.406: C2.- 46.4,45.79 R6.1 47.35,50.93 X1.2
N$1  (via drill 0.3)
  Top 0.305: v61.91,14.67 61.91,41.97 60.96,42.93 60.96,54.29 62.42,55.75 JP1.5
  Bottom 0.406: R3.2 v61.91,14.67
N$2
  Bottom 0.406: J1.P$2 1.67,48.39 1.67,54.03 3.59,55.95 28.83,55.95 30.1,54.68 R40.2
N$3
  Bottom 0.305: IC1.2 55.67,28.64 | 55.67,28.64 R13.2 | C3.1 56.51,29.49 55.67,28.64
N$4
  Bottom 0.305: IC1.7 55.84,20.49 C4.2 R16.2
N$5
  Bottom 0.305: IC1.6 55.88,23.56 | 55.88,23.56 55.98,23.56 R15.2 | C4.1 56.51,22.92 55.88,23.56
N$6
  Bottom 0.305: IC1.1 55.52,31.39 C3.2 R14.2
N$7
  Bottom 0.305: R26.2 44.88,22.19 C17.1 46.57,21.97 46.57,22.19 47.94,23.56 IC1.9
N$8
  Bottom 0.305: R32.1 C15.+
N$9
  Bottom 0.305: C21.- 59.83,13.64 R34.1
N$10
  Bottom 0.305: C14.+ R28.1
N$11
  Bottom 0.305: R27.2 44.66,25.36 C19.2 47.52,24.83 IC1.10
N$12  (via drill 0.3)
  Top 0.305: v44.45,18.16 44.45,30.86 v45.4,31.81 | v49.35,18.16 v49.35,15.62
  Bottom 0.305: 44.13,17.84 v44.45,18.16 | 44.45,31.92 R29.2 v45.4,31.81 46.25,31.81 C18.2 46.57,31.5 47.25,31.5 IC1.14 | C22.+ 43.18,16.89 v44.45,18.16 | v44.45,18.16 v49.35,18.16 | v49.35,15.62 R35.1
N$13
  Bottom 0.305: C22.- R36.1
N$14  (via drill 0.3)
  Top 0.254: v25.67,16.63 25.67,25.28 28.27,27.88 28.27,34.08 29.72,35.53 45.37,35.53 46.47,34.43 49.72,34.43 LED1.P2
  Bottom 0.254: R11.2 v25.67,16.63
N$15
  Bottom 0.305: R27.1 42.66,23.66 R22.2 42.33,23.88 C10.1 R28.2
N$16  (via drill 0.3)
  Top 0.254: v48.57,2.43 43.62,2.43 41.97,4.08 38.29,4.08 37.57,3.35 33.11,3.35 31.34,5.13 19.42,5.13 18.77,5.78 18.77,32.43 19.42,33.08 27.02,33.08 27.57,33.63 27.57,34.28 29.57,36.28 45.62,36.28 46.07,35.83 LED1.P1
  Bottom 0.305: R9.2 v48.57,2.43
N$17  (via drill 0.3)
  Top 0.254: v48.57,1.08 44.07,1.08 41.67,3.48 38.67,3.48 37.82,2.63 19.07,2.63 17.85,3.84 17.85,34.21 19.27,35.63 28.02,35.63 29.72,37.33 LED1.P4
  Bottom 0.305: v48.57,1.08 R10.2
N$19
  Bottom 0.305: R12.1 82.07,38.43 J5.P$3
N$20
  Bottom 0.305: R17.1 J6.P$3
N$21  (via drill 0.3)
  Top 0.305: v68.48,13 68.52,13.03 68.52,14.99 72.96,19.43 72.96,23.79 70.83,25.92 70.83,29.99 72.76,31.92 J4.P$3
  Bottom 0.305: R18.1 v68.48,13
N$22  (via drill 0.3)
  Top 0.305: J2.P$3 15.81,37.37 15.8,37.36 v15.8,18.83
  Bottom 0.305: R1.1 10.03,18.83 13.22,18.83 v15.8,18.83
N$23
  Bottom 0.305: J3.P$2 30.85,46.94 29.78,48.01 29.78,52.03 R39.2
N$24
  Bottom 0.305: R30.1 R29.1 R23.2 C11.1
N$25  (via drill 0.3)
  Top 0.254: v32.92,27.38 P2.3
  Bottom 0.254: R41.2 27.92,36.53 27.02,35.63 27.02,31.03 30.67,27.38 v32.92,27.38
N$26
  Bottom 0.305: R30.2 44.56,30.01 C18.1 46.57,30.23 46.57,30.01 47.94,28.64 IC1.13
N$27
  Bottom 0.254: R41.1 J3.P$3
N$30
  Bottom 0.305: R31.2 46.15,28.54 C20.2 47.52,27.37 IC1.12
N$31
  Bottom 0.305: R42.2 8.82,21.49 P1.3
N$32
  Bottom 0.305: R32.2 36.41,30.65 40,27.05 C12.1 42.33,28.64 R24.2 42.54,28.54 R31.1
N$33
  Bottom 0.305: J1.P$3 3.11,33.13 8.82,27.43 R42.1
N$37
  Bottom 0.305: T1.1 R1.2 R2.2
N$39  (via drill 0.3)
  Top 0.305: v47.79,16.89 v47.79,20.38
  Bottom 0.305: R25.2 44.77,20.49 C17.2 46.46,20.38 v47.79,20.38 48.84,21.42 IC1.8 48.89,22.23 | C21.+ v47.79,16.89 R33.1
N$41
  Bottom 0.305: R25.1 R26.1 R21.2 C9.1
OUT_L
  Bottom 0.305: R34.2 R37.1 59.86,11.23 59.77,11.33 58.67,11.33 57.47,12.53 54.27,12.53 51.67,9.93 45.09,9.93 X2.3
OUT_R  (via drill 0.3)
  Top 0.305: v34.14,15.27 34.14,6.78 X2.2
  Bottom 0.305: v34.14,15.27 v34.14,15.28 R38.1 R36.2
USB_D_VBUS
  Top 0.406: JP10.4 22.48,47.05 21.53,48.01 21.53,52.56 VBUS.1
USB_H_D+
  Bottom 0.254: JP14.2 24.12,43.26 24.12,50.28 23.22,51.18 18.72,51.18 17.92,50.38 15.77,50.38 15.27,49.88 10.4,49.88 U1.3
USB_H_D-
  Bottom 0.254: JP14.1 25.42,44.53 25.42,45.78 24.67,46.53 24.67,50.63 23.52,51.78 18.52,51.78 17.67,50.93 15.87,50.93 14.32,52.48 12.39,52.48 U1.2
USB_H_VBUS  (via drill 0.35)
  Top 0.305: v13.58,49.06 v13.6,49.08
  Top 0.406: v13.6,49.08 U1.1
  Bottom 0.254: C25.2 11.22,47.83 11.92,47.13 11.92,44.78 15.32,41.38 18.77,41.38 23.25,36.89 JP14.4
  Bottom 0.305: C24.2 7.3,49.02 | 13.54,49.02 v13.58,49.06
  Bottom 0.406: C24.2 C25.2 U3.6 | 7.3,49.02 13.54,49.02

### Text on the board
tPlace: Rebel Technology | Wizard Rev02 | 5v
bPlace: Rebel Technology | Wizard Rev02 | 3v3 | gnd | 5v